# Altium schematic sheet MQ135.SchDoc
size A4
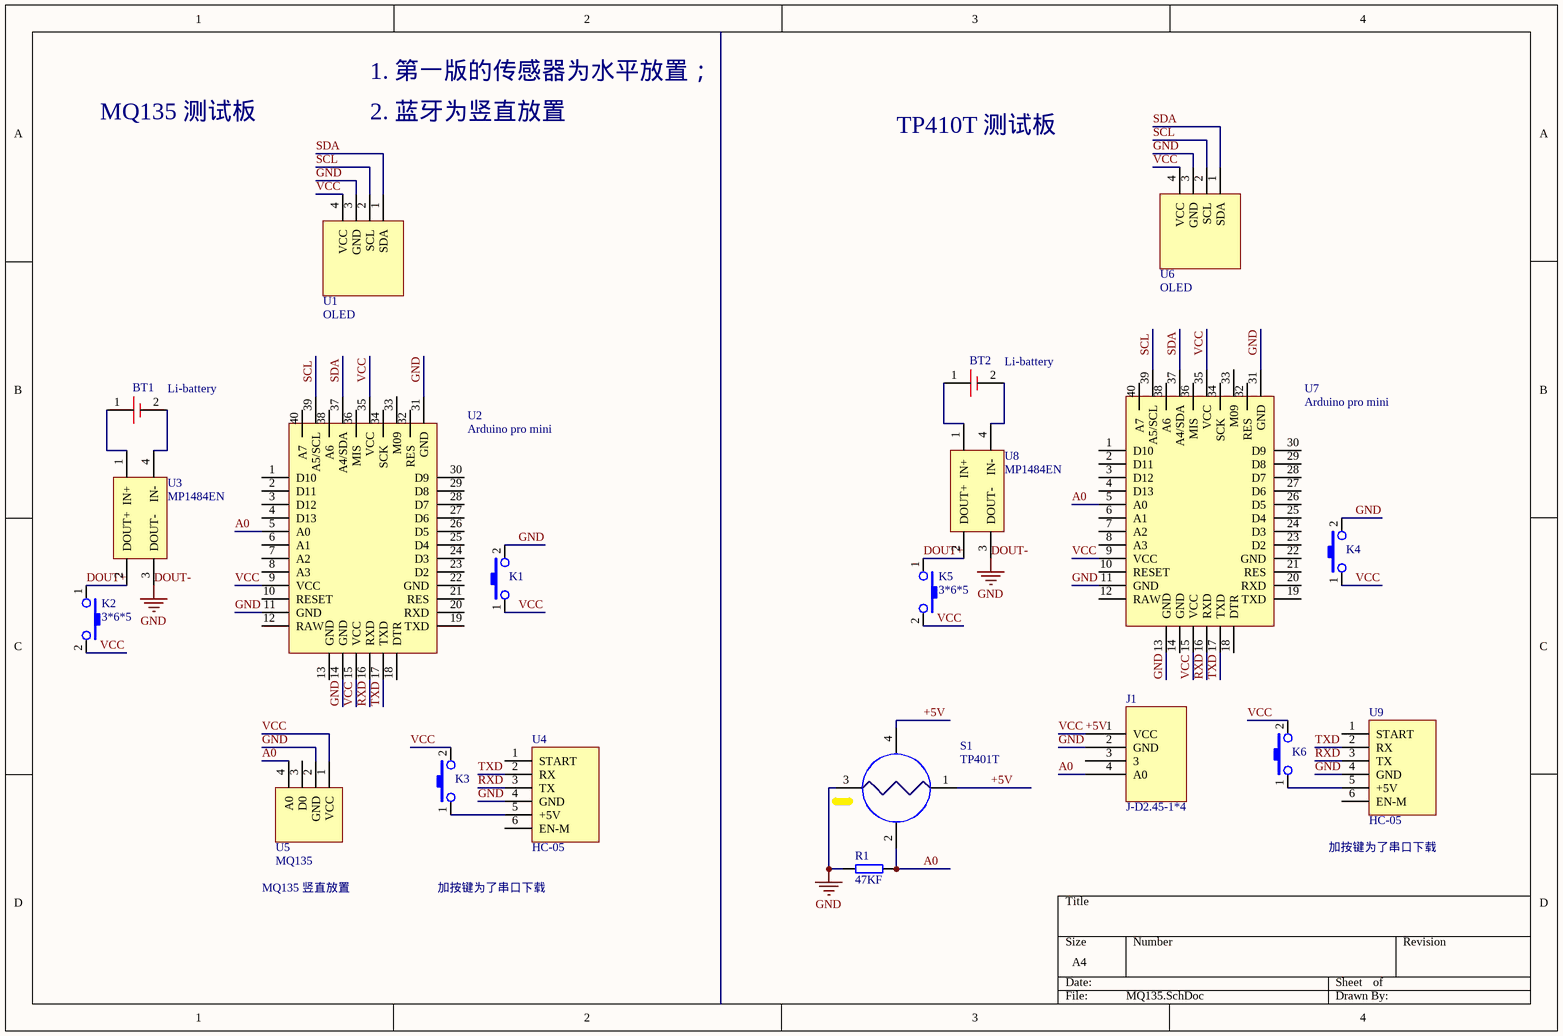
[diagram p0: MQ135.SchDoc]

## Parts
BT1  Li-battery  [LIR2032]
BT2  Li-battery  [LIR2032]
J1  J-D2.45-1*4  [D2.54-1*4P]
K1  3*6*5  [S-K3*6]  (value not drawn)
K2  3*6*5  [S-K3*6]
K3  3*6*5  [S-K3*6]  (value not drawn)
K4  3*6*5  [S-K3*6]  (value not drawn)
K5  3*6*5  [S-K3*6]
K6  3*6*5  [S-K3*6]  (value not drawn)
R1  47KF  [R0603]
S1  TP401T
U1  OLED
U2  Arduino pro mini
U3  MP1484EN
U4  HC-05
U5  MQ135
U6  OLED
U7  Arduino pro mini
U8  MP1484EN
U9  HC-05

## Nets
DOUT-: J1.2(GND) K1.2 K4.2 R1.2 S1.3 U1.3(GND) U2.11(GND) U2.14(GND) U2.31(GND) U3.3(DOUT-) U4.4(GND) U5.2(GND) U6.3(GND) U7.11(GND) U7.13(GND) U7.31(GND) U8.3(DOUT-) U9.4(GND)  [also labelled GND]
+5V: J1.1(VCC) K1.1 K2.2 K3.2 K4.1 K5.2 K6.2 S1.1 S1.4 U1.4(VCC) U2.9(VCC) U2.15(VCC) U2.35(VCC) U5.1(VCC) U6.4(VCC) U7.9(VCC) U7.15(VCC) U7.35(VCC)  [also labelled VCC]
A0: J1.4(A0) R1.1 S1.2 U2.5(A0) U5.4(A0) U7.5(A0)
DOUT+: K2.1 K5.1 U3.2(DOUT+) U8.2(DOUT+)
RXD: U2.16(RXD) U4.3(TX) U7.16(RXD) U9.3(TX)
SCL: U1.2(SCL) U2.39(A5/SCL) U6.2(SCL) U7.39(A5/SCL)
SDA: U1.1(SDA) U2.37(A4/SDA) U6.1(SDA) U7.37(A4/SDA)
TXD: U2.17(TXD) U4.2(RX) U7.17(TXD) U9.2(RX)
NetBT1_1: BT1.1(VCC) U3.1(IN+)
NetBT1_2: BT1.2(GND) U3.4(IN-)
NetBT2_1: BT2.1(VCC) U8.1(IN+)
NetBT2_2: BT2.2(GND) U8.4(IN-)
NetK3_1: K3.1 U4.5(+5V)
NetK6_1: K6.1 U9.5(+5V)

Not connected (* = marked no-connect by the designer): J1 3; U2 1(D10) 2(D11) 3(D12) 4(D13) 6(A1) 7(A2) 8(A3) 10(RESET) 12(RAW) 13(GND) 18(DTR) 19(TXD) 20(RXD) 21(RES) 22(GND) 23(D2) 24(D3) 25(D4) 26(D5) 27(D6) 28(D7) 29(D8) 30(D9) 32(RES) 33(M09) 34(SCK) 36(MIS) 38(A6) 40(A7); U4 1(START) 6(EN-M); U5 3(D0); U7 1(D10) 2(D11) 3(D12) 4(D13) 6(A1) 7(A2) 8(A3) 10(RESET) 12(RAW) 14(GND) 18(DTR) 19(TXD) 20(RXD) 21(RES) 22(GND) 23(D2) 24(D3) 25(D4) 26(D5) 27(D6) 28(D7) 29(D8) 30(D9) 32(RES) 33(M09) 34(SCK) 36(MIS) 38(A6) 40(A7); U9 1(START) 6(EN-M)

## Notes on the sheet
- 1. 第一版的传感器为水平放置；
- MQ135 测试板
- 2. 蓝牙为竖直放置
- TP410T 测试板
- (near U9) 加按键为了串口下载
- MQ135 竖直放置
- 加按键为了串口下载

## Library data of the parts
BT1 BT2 = Li-batttery: 纽扣电池LIR2023
J1 = J-D2.54-1*4单排排母_1: TP401T 气敏传感器
K1-K6 = 3*6*5: 贴片-卧式轻触开关
R1 = R0603-47KF: 贴片电阻-通用; 生产商: 厚声 国巨; 规格型号: 47K±1%_1/10W_±200ppm_R0603; 货品编码: 无样品无编码; 备注: *; 供应商: *
S1 = TP401T: 异味传感器
U1 U6 = OLED: OLED IIC屏幕显示
U2 U7 = Arduino pro mini: Pro mini
U3 U8 = DC稳压模块: MP1484EN 稳压模块 5V
U4 U9 = HC-05: Bluetooth model
U5 = MQ135: 气敏传感器